# EAGLE design gambaran rev1 (EAGLE 9.2.2)
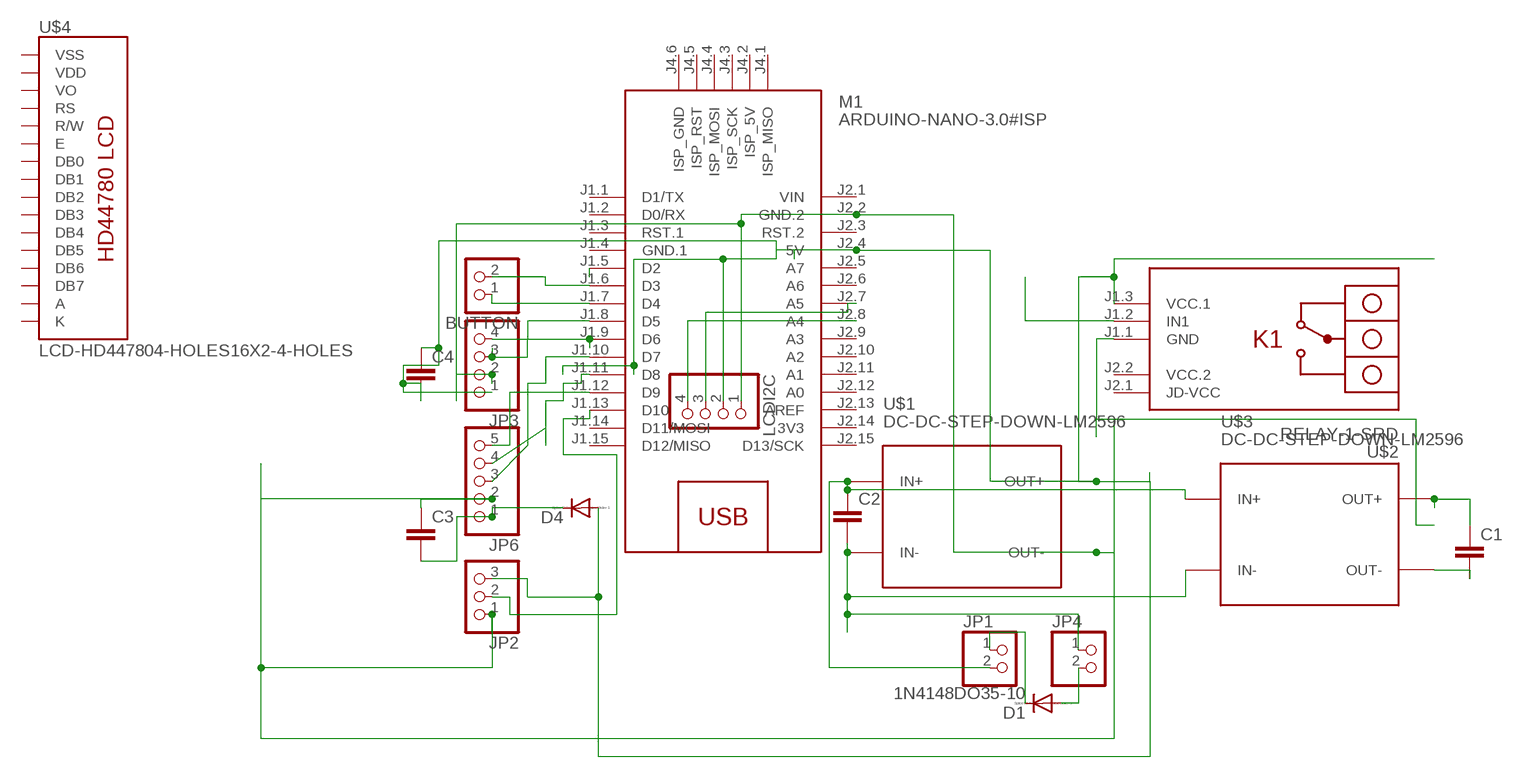
[diagram p0: schematic, sheet 1]

## Parts
BUTTON  PINHD-1X2/90  [1X02/90]
C1  C2.5/6  [C2.5-6]
C2  C2.5/6  [C2.5-6]
C3  C2.5/6  [C2.5-6]
C4  C2.5/6  [C2.5-6]
D1  1N4148DO35-10  [DO35-10]
D4  1N4148DO35-10  [DO35-10]
JP1  PINHD-1X2/90  [1X02/90]
JP2  PINHD-1X3  [1X03]
JP3  PINHD-1X4/90  [1X04/90]
JP4  PINHD-1X2/90  [1X02/90]
JP6  PINHD-1X5  [1X05]
LCDI2C  PINHD-1X4/90  [1X04/90]
M1  ARDUINO-NANO-3.0#ISP  [ARDUINO-NANO-3.0#ISP]
U$1  DC-DC-STEP-DOWN-LM2596  [DC-DC-STEP-DOWN-LM2596]
U$2  RELAY-1-SRD  [RELAY-1-SRD]
U$3  DC-DC-STEP-DOWN-LM2596  [DC-DC-STEP-DOWN-LM2596]
U$4  LCD-HD447804-HOLES16X2-4-HOLES  [LCD-16X2-4HOLES]

## Nets
N$1: C2.2 JP4.1 U$1.IN- U$3.IN-
N$2: C2.1 JP1.2 U$1.IN+ U$3.IN+
N$3: C3.2 D4.C JP6.1
N$4: C4.1 C4.2 D4.A JP2.3 JP3.1 LCDI2C.2 M1.J2.4(5V) U$1.OUT+ U$2.J1.3(VCC.1)
N$5: LCDI2C.3 M1.J2.7(A5)
N$6: LCDI2C.4 M1.J2.8(A4)
N$7: C1.1 U$3.OUT+
N$8: C3.1 JP2.1 JP3.2 JP6.2 LCDI2C.1 M1.J2.2(GND.2) U$1.OUT- U$2.J1.1(GND)
N$9: U$2.J1.2(IN1)
N$10: D1.C JP1.1
N$11: D1.A JP4.2
N$12: C1.2 U$3.OUT-
N$13: BUTTON.2 M1.J1.6(D3)
N$14: BUTTON.1 M1.J1.7(D4)
N$16: JP3.4 M1.J1.9(D6)
N$17: JP6.3 M1.J1.10(D7)
N$18: JP6.4 M1.J1.11(D8)
N$19: JP3.3 M1.J1.8(D5)
N$20: M1.J1.5(D2)
N$21: JP6.5 M1.J1.12(D9)
N$23: JP2.2 M1.J1.13(D10)
Unconnected: M1.J1.1(D1/TX) M1.J1.2(D0/RX) M1.J1.3(RST.1) M1.J1.14(D11/MOSI) M1.J1.15(D12/MISO) M1.J2.3(RST.2) M1.J2.5(A7) M1.J2.6(A6) M1.J2.9(A3) M1.J2.10(A2) M1.J2.11(A1) M1.J2.12(A0) M1.J2.13(AREF) M1.J2.15(D13/SCK) M1.J4.1(ISP_MISO) M1.J4.2(ISP_5V) M1.J4.3(ISP_SCK) M1.J4.4(ISP_MOSI) M1.J4.5(ISP_RST) M1.J4.6(ISP_GND) U$2.J2.1(JD-VCC) U$4.3(VO) U$4.4(RS) U$4.5(R/W) U$4.6(E) U$4.7(DB0) U$4.8(DB1) U$4.9(DB2) U$4.10(DB3) U$4.11(DB4) U$4.12(DB5) U$4.13(DB6) U$4.14(DB7)

## Power pins joined to a net without a drawn wire
3V3: M1.J2.14(3V3)
A: U$4.15(A)
GND.1: M1.J1.4(GND.1)
K: U$4.16(K)
VCC.2: U$2.J2.2(VCC.2)
VDD: U$4.2(VDD)
VIN: M1.J2.1(VIN)
VSS: U$4.1(VSS)

## Library data of the parts
BUTTON JP1 JP4 = pinhead:PINHD-1X2: PIN HEADER
C1-C4 = capacitor-wima:C: CAPACITOR naming: grid - package width
D1 D4 = diode:1N4148: DIODE high speed (Philips)
JP2 = pinhead:PINHD-1X3: PIN HEADER
JP3 LCDI2C = pinhead:PINHD-1X4: PIN HEADER
JP6 = pinhead:PINHD-1X5: PIN HEADER
M1 = diy-modules:ARDUINO-NANO-3.0#ISP: Arduino Nano 3.0 (and compatible devices) with ISP pads More details available here: https://www.arduino.cc/en/Main/ArduinoBoardNano Click here to find device on ebay.com <http://www.ebay.com/sch/arduino+nano>
U$1 U$3 = diy-modules:DC-DC-STEP-DOWN-LM2596: DC/DC Step-Down Regulator based on LM2596-ADJ chip LM2596 datasheet available here: http://www.ti.com/lit/ds/symlink/lm2596.pdf Click here to find device on ebay.com <http://www.ebay.com/sch/lm2596+power+regulator>
U$2 = diy-modules:RELAY-1-SRD: 1-Channel Relay Module based on SRD-05VDC-SL-C relays Click here to find device on ebay.com <http://www.ebay.com/sch/one+channel+isolated+relay+5v>
U$4 = LCD:LCD-HD44780

## Board
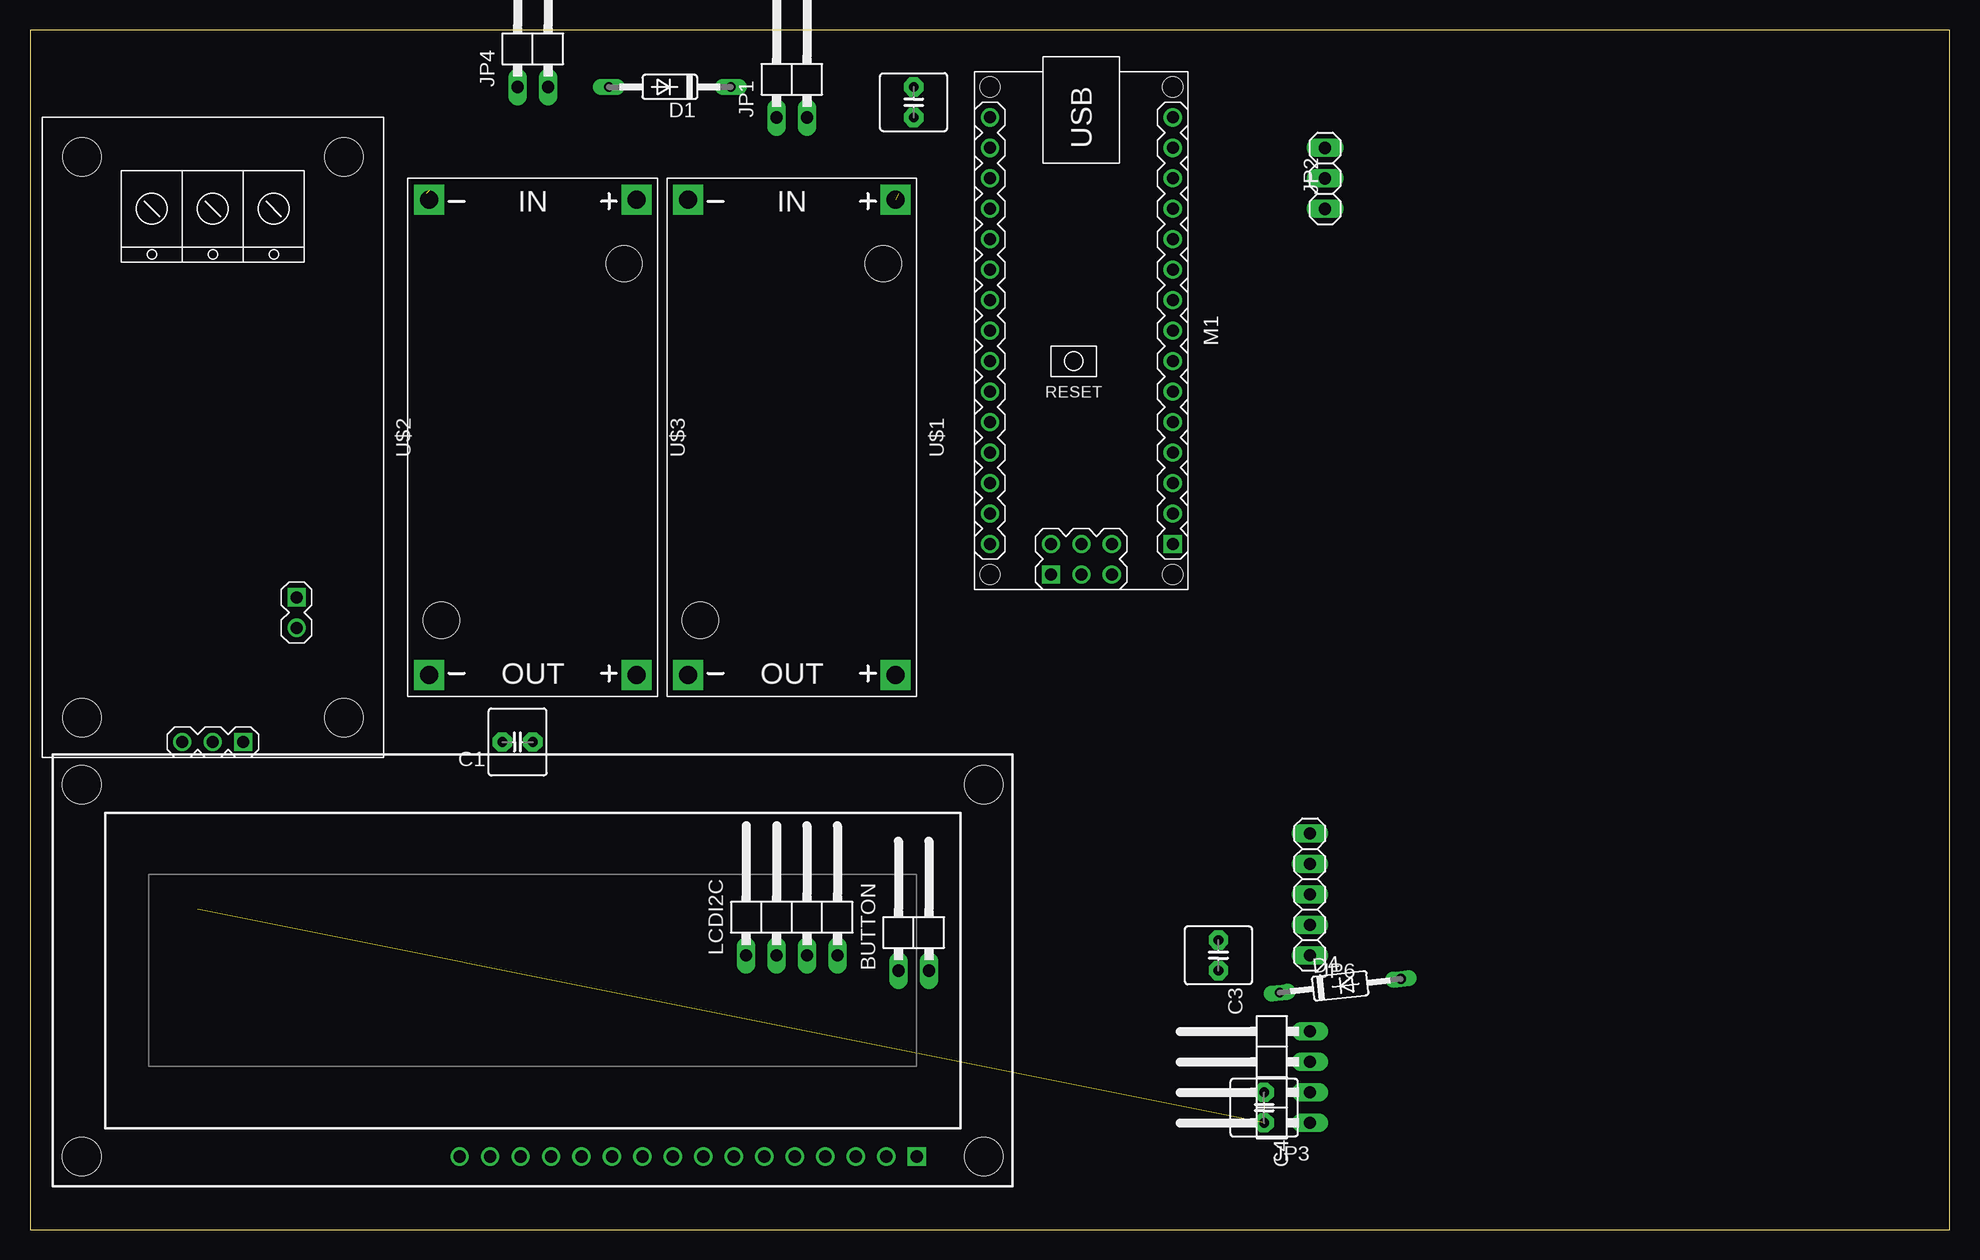
[diagram p1: board, top side]
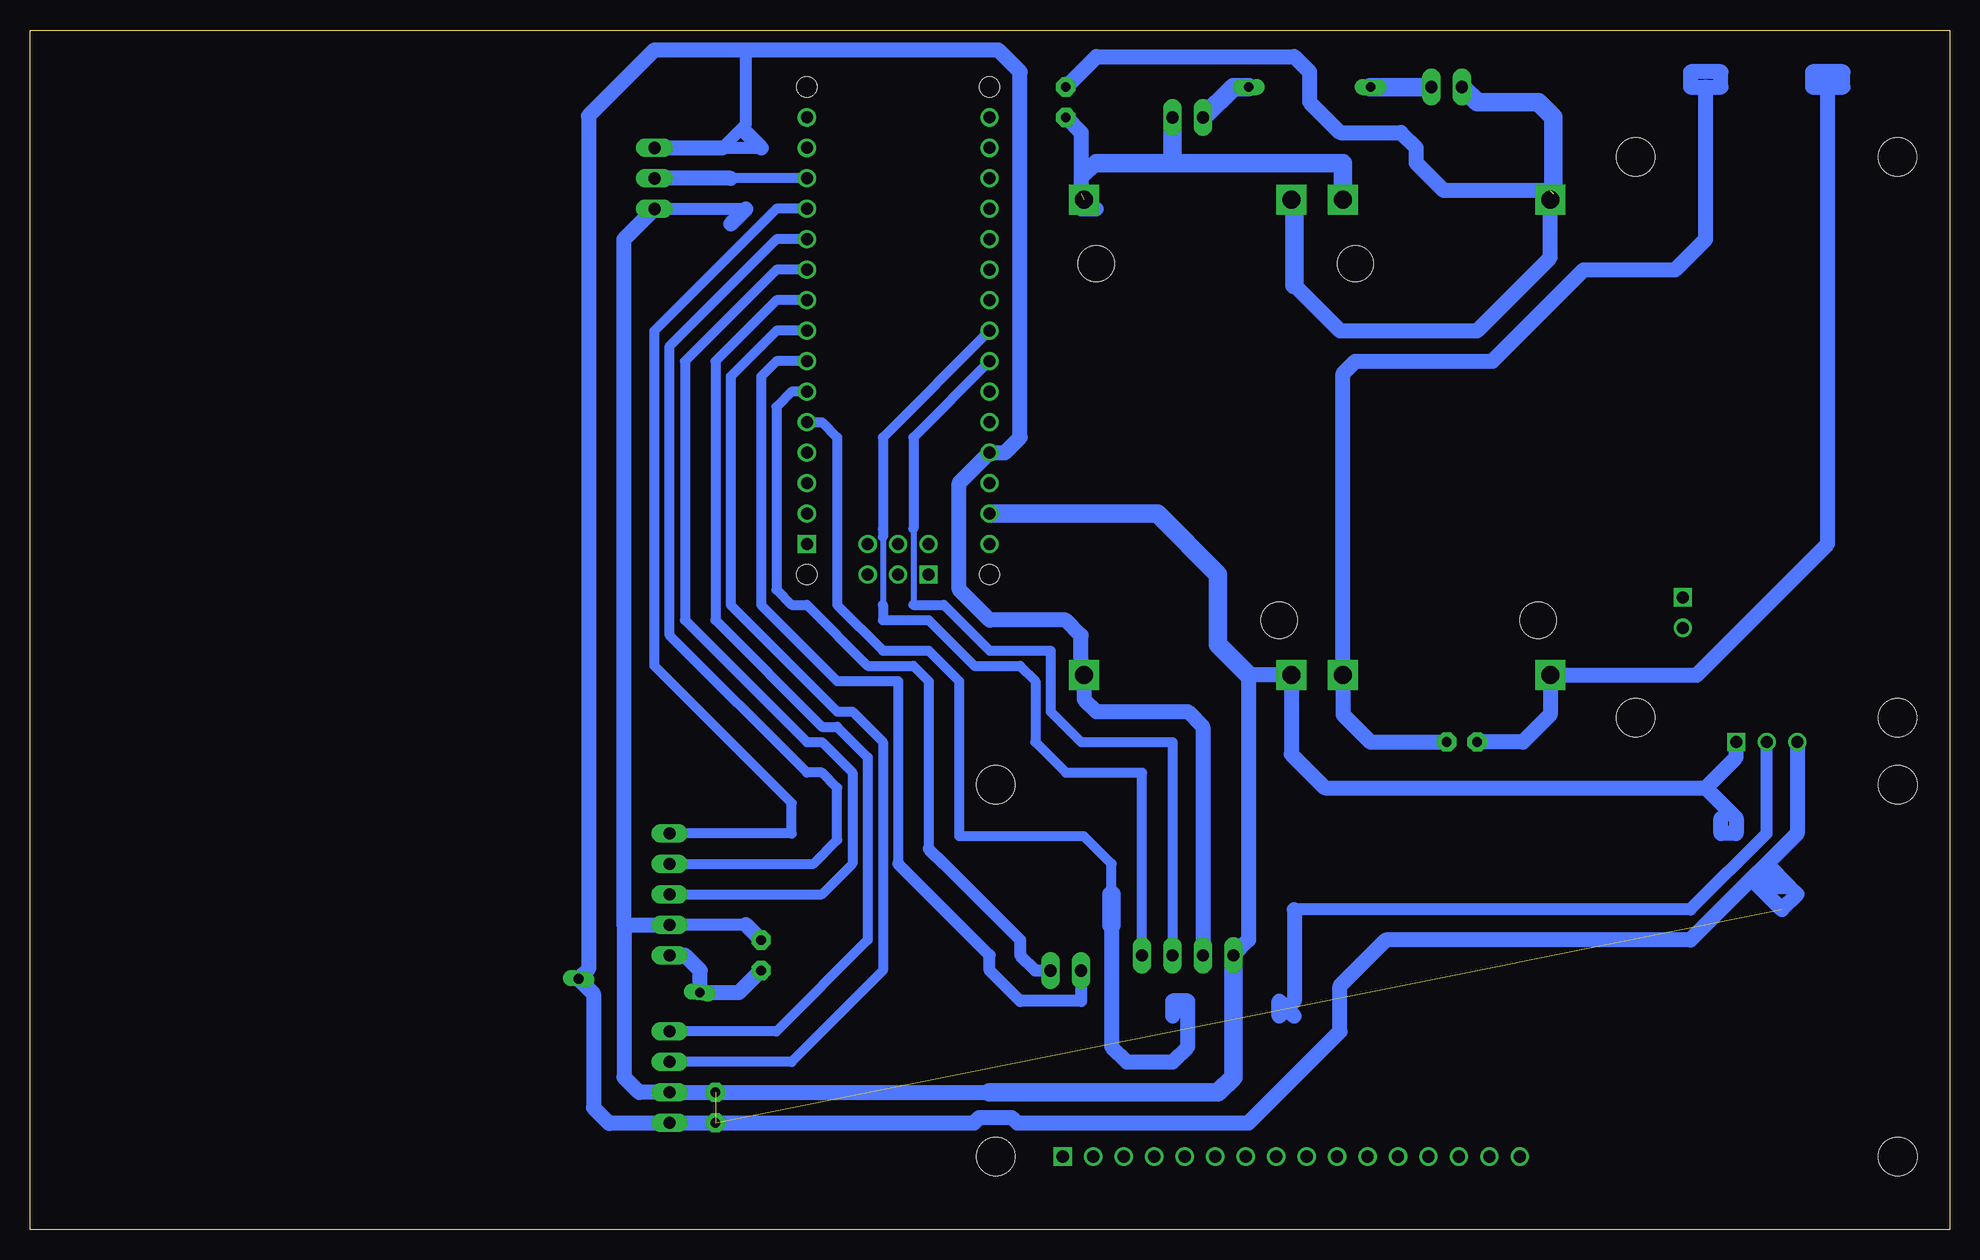
[diagram p2: board, bottom side, seen from below]

Size 160 x 100 mm. Coordinates in mm from the lower left corner, seen from the top.
Outline: 0,0 160,0 160,100 0,100 0,0
Copper layers (1*16): Top 0.035mm / dielectric 1.5mm / Bottom 0.035mm
Design rules "default": minimum track width 6mil, minimum drill 0.35mm, track to track 6mil, track to pad 6mil, pad to pad 6mil, via to via 6mil, smd to smd 6mil, copper to edge 40mil, drill to drill 6mil, minimum pad ring 10mil, minimum via ring 8mil, stop-mask expansion 4mil, vias tented up to drill 0mil, thermal gap 10mil

### Footprints (pad centres in the part's own frame; a part is rotated, then mirrored left to right if it is on the bottom)
1X02/90 = drill 1.016 long: 1 -1.27,-3.81; 2 1.27,-3.81
C2.5-6 = drill 0.813 pad 1.6 octagon: 1 -1.27,0; 2 1.27,0
DO35-10 = drill 0.813 long: A 5.08,0; C -5.08,0
1X03 = drill 1.016 long: 1 -2.54,0; 2 0,0; 3 2.54,0
1X04/90 = drill 1.016 long: 1 -3.81,-3.81; 2 -1.27,-3.81; 3 1.27,-3.81; 4 3.81,-3.81
1X05 = drill 1.016 long: 1 -5.08,0; 2 -2.54,0; 3 0,0; 4 2.54,0; 5 5.08,0
ARDUINO-NANO-3.0#ISP = drill 1 square: J1.1 17.78,7.62; J4.1 20.32,-2.54 | drill 1: J1.2 15.24,7.62; J1.3 12.7,7.62; J1.4 10.16,7.62; J1.5 7.62,7.62; J1.6 5.08,7.62; J1.7 2.54,7.62; J1.8 0,7.62; J1.9 -2.54,7.62; J1.10 -5.08,7.62; J1.11 -7.62,7.62; J1.12 -10.16,7.62; J1.13 -12.7,7.62; J1.14 -15.24,7.62; J1.15 -17.78,7.62; J2.1 17.78,-7.62; J2.2 15.24,-7.62; J2.3 12.7,-7.62; J2.4 10.16,-7.62; J2.5 7.62,-7.62; J2.6 5.08,-7.62; J2.7 2.54,-7.62; J2.8 0,-7.62; J2.9 -2.54,-7.62; J2.10 -5.08,-7.62; J2.11 -7.62,-7.62; J2.12 -10.16,-7.62; J2.13 -12.7,-7.62; J2.14 -15.24,-7.62; J2.15 -17.78,-7.62; J4.2 17.78,-2.54; J4.3 20.32,0; J4.4 17.78,0; J4.5 20.32,2.54; J4.6 17.78,2.54 | hole 1.651: -20.32,7.62; -20.32,-7.62; 20.32,-7.62; 20.32,7.62
DC-DC-STEP-DOWN-LM2596 = drill 1.5 pad 2.5 square: IN+ -19.812,8.636; IN- -19.812,-8.636; OUT+ 19.812,8.636; OUT- 19.812,-8.636 | hole 3: -14.478,7.62; 15.24,-7.62
RELAY-1-SRD = drill 1 square: J1.1 25.4,2.54; J2.1 13.335,6.985 | drill 1: J1.2 25.4,0; J1.3 25.4,-2.54; J2.2 15.875,6.985 | hole 3.2: -23.368,10.922; 23.368,10.922; 23.368,-10.922; -23.368,-10.922
LCD-16X2-4HOLES = drill 1.016 square: 1 -32,15.5 | drill 1.016: 2 -29.46,15.5; 3 -26.92,15.5; 4 -24.38,15.5; 5 -21.84,15.5; 6 -19.3,15.5; 7 -16.76,15.5; 8 -14.22,15.5; 9 -11.68,15.5; 10 -9.14,15.5; 11 -6.6,15.5; 12 -4.06,15.5; 13 -1.52,15.5; 14 1.02,15.5; 15 3.56,15.5; 16 6.1,15.5 | hole 3.2: -37.6,15.5; -37.6,-15.5; 37.6,-15.5; 37.6,15.5

### Placement (x,y rotation side)
BUTTON  73.66,25.4 0 top
C1  40.64,40.64 180 top
C2  73.66,93.98 90 top
C3  99.06,22.86 270 top
C4  102.87,10.16 270 top
D1  53.34,95.25 180 top
D4  109.22,20.32 6.4 top
JP1  63.5,96.52 0 top
JP2  107.95,87.63 90 top
JP3  102.87,12.7 90 top
JP4  41.91,99.06 0 top
JP6  106.68,27.94 90 top
LCDI2C  63.5,26.67 0 top
M1  87.63,74.93 270 top
U$1  63.5,66.04 270 top
U$2  15.24,66.04 270 top
U$3  41.91,66.04 270 top
U$4  41.91,21.59 180 top

### Tracks (layer width: path | path; a pad name or v marks a point on that pad's centre or on a via)
N$1  (1 unrouted)
  Bottom 1.27: 54.61,78.74 50.8,74.93 39.37,74.93 33.27,81.03 U$3.IN- 33.27,86.61 42.16,86.61 44.45,88.9 44.45,90.17 45.72,91.44 50.8,91.44 53.34,93.98 53.34,96.52 54.61,97.79 71.12,97.79 C2.2
  Bottom 1.524: 33.02,86.36 33.02,92.71 34.29,93.98 39.37,93.98 JP4.1 | U$1.IN- 54.61,85.6 54.61,78.74
N$2  (1 unrouted)
  Bottom 1.27: 72.39,87.63 72.39,86.36 72.39,85.09 71.12,85.09 | 71.12,88.9 72.39,87.63 | C2.1 72.39,91.44 72.39,87.63
  Bottom 1.524: U$3.IN+ 50.55,88.9 64.77,88.9 | 64.77,88.9 71.12,88.9 | JP1.2 64.77,88.9
N$3
  Bottom 1.27: JP6.1 105.41,22.86 104.14,21.59 104.17,21.56 D4.C 100.9,19.75 C3.2
N$4  (2 unrouted)
  Bottom 1.016: 100.33,98.35 100.33,92.13 102.29,90.17 99.06,90.17
  Bottom 1.27: JP2.3 102.29,90.17 | JP3.1 111.63,8.89 111.69,8.82 113.03,10.16 113.03,19.65 D4.A 113.45,21.7 113.45,92.84 107.95,98.35 100.33,98.35 79.3,98.35 77.47,96.52 77.47,66.04 78.74,64.77 M1.J2.4 82.55,62.23 82.55,53.34 80.01,50.8 73.66,50.8 72.39,49.53 72.39,46.48 U$1.OUT+ 72.14,44.2 71.12,43.18 63.5,43.18 62.23,41.91 LCDI2C.2 | JP3.1 101.6,8.89 | JP3.1 81.31,8.89 80.86,9.34 78.16,9.34 77.71,8.89 58.42,8.89 50.8,16.51 50.8,20.32 46.99,24.13 21.59,24.13 16.51,29.21 | 99.06,90.17 100.33,91.44 | U$2.J1.3 12.7,33.02 15.24,30.48 | 15.24,30.48 16.51,29.21 | 15.24,30.48 13.34,28.57 | 13.34,28.57 12.7,27.94 13.97,26.67 16.51,29.21 | 13.34,28.57 14.61,28.57 15.24,29.21
N$5
  Bottom 0.508: 86.36,58.42 86.36,52.07
  Bottom 0.813: LCDI2C.3 64.77,40.64 72.39,40.64 74.93,43.18 74.93,48.26 80.01,48.26 83.82,52.07 86.36,52.07 | M1.J2.7 86.36,66.04 86.36,58.42
N$6
  Bottom 0.508: 88.9,58.42 88.9,52.07
  Bottom 0.813: LCDI2C.4 67.31,38.1 73.66,38.1 76.2,40.64 76.2,45.72 77.47,46.99 81.28,46.99 85.09,50.8 88.9,50.8 88.9,52.07 | M1.J2.8 88.9,66.04 88.9,58.42 88.9,57.74
N$7
  Bottom 1.27: C1.1 48.26,40.64 50.55,42.93 U$3.OUT+ 50.55,71.37 49.53,72.39 38.1,72.39 30.48,80.01 22.86,80.01 20.32,82.55 20.32,95.25 | 20.32,95.25 19.05,95.25 19.05,96.52 21.59,96.52 21.59,95.25 20.32,95.25
N$8
  Bottom 1.016: U$1.OUT- 55.88,46.23 | 100.33,25.4 JP6.2 | JP2.1 100.33,85.09
  Bottom 1.27: 55.88,46.23 58.42,46.23 58.42,24.13 LCDI2C.1 | 110.49,25.4 110.49,12.7 109.22,11.43 JP3.2 78.74,11.43 | 110.49,25.4 JP6.2 | 110.49,25.4 110.49,82.55 JP2.1 | U$1.OUT- 54.86,39.62 52.07,36.83 20.32,36.83 | 100.33,85.09 101.6,83.82 | 20.32,36.83 17.78,39.37 U$2.J1.1 | 20.32,36.83 17.78,34.29 17.78,33.02 19.05,33.02 19.05,34.29 | C3.1 100.33,25.4
  Bottom 1.524: LCDI2C.1 59.69,12.7 60.96,11.43 78.74,11.43 80.01,11.43 | 58.42,46.23 60.96,48.77 60.96,54.61 66.04,59.69 M1.J2.2
N$9
  Bottom 1.016: U$2.J1.2 15.24,33.02 21.59,26.67 54.61,26.67
  Bottom 1.27: 54.61,26.67 54.61,19.05 55.88,17.78 55.88,19.05 54.61,17.78
N$10
  Bottom 1.524: JP1.1 59.69,95.25 D1.C
N$11
  Bottom 1.524: JP4.2 D1.A
N$12
  Bottom 1.27: C1.2 35.56,40.64 33.27,42.93 U$3.OUT- 21.08,46.23 10.16,57.15 10.16,96.52 | 10.16,96.52 8.89,96.52 8.89,95.25 11.43,95.25 11.43,96.52 10.16,96.52
N$13
  Bottom 0.813: M1.J1.6 96.52,69.85 97.79,68.58 97.79,53.34 96.52,52.07 95.25,52.07 90.17,46.99 86.36,46.99 85.09,45.72 85.09,31.75
  Bottom 1.016: 85.09,31.75 83.82,30.48 77.47,24.13 77.47,22.86 76.2,21.59 BUTTON.2
N$14
  Bottom 0.813: M1.J1.7 97.79,72.39 99.06,71.12 99.06,52.07 92.71,45.72 87.63,45.72 87.63,30.48
  Bottom 1.016: BUTTON.1 72.39,19.05 77.47,19.05 80.01,21.59 80.01,22.86 87.63,30.48
N$16
  Bottom 0.813: JP3.4 97.79,16.51 90.17,24.13 90.17,39.37 92.71,41.91 93.98,41.91 102.87,50.8 102.87,72.39 97.79,77.47 M1.J1.9
N$17
  Bottom 0.813: M1.J1.10 97.79,80.01 105.41,72.39 105.41,50.8 95.25,40.64 93.98,40.64 91.44,38.1 91.44,30.48 93.98,27.94 JP6.3
N$18
  Bottom 0.813: M1.J1.11 97.79,82.55 106.68,73.66 106.68,49.53 95.25,38.1 93.98,38.1 92.71,36.83 92.71,32.48 94.71,30.48 JP6.4
N$19
  Bottom 0.813: JP3.3 96.52,13.97 88.9,21.59 88.9,40.64 91.44,43.18 92.71,43.18 101.6,52.07 101.6,71.12 97.79,74.93 M1.J1.8
N$20
  Bottom 0.813: 69.85,26.67 69.85,27.94 69.85,30.48 72.17,32.8 82.55,32.8 82.55,45.72 85.09,48.26 88.9,48.26 92.71,52.07 92.71,66.04 93.98,67.31 M1.J1.5
  Bottom 1.27: 69.85,25.4 69.85,15.24 68.58,13.97 64.77,13.97 63.5,15.24 63.5,19.05 64.77,19.05 64.77,17.78
  Bottom 1.524: 69.85,27.94 69.85,25.4
N$21
  Bottom 0.813: M1.J1.12 97.79,85.09 107.95,74.93 107.95,46.99 96.52,35.56 96.52,33.02 JP6.5
N$23
  Bottom 0.813: M1.J1.13 101.6,87.63
  Bottom 1.27: 101.6,87.63 JP2.2